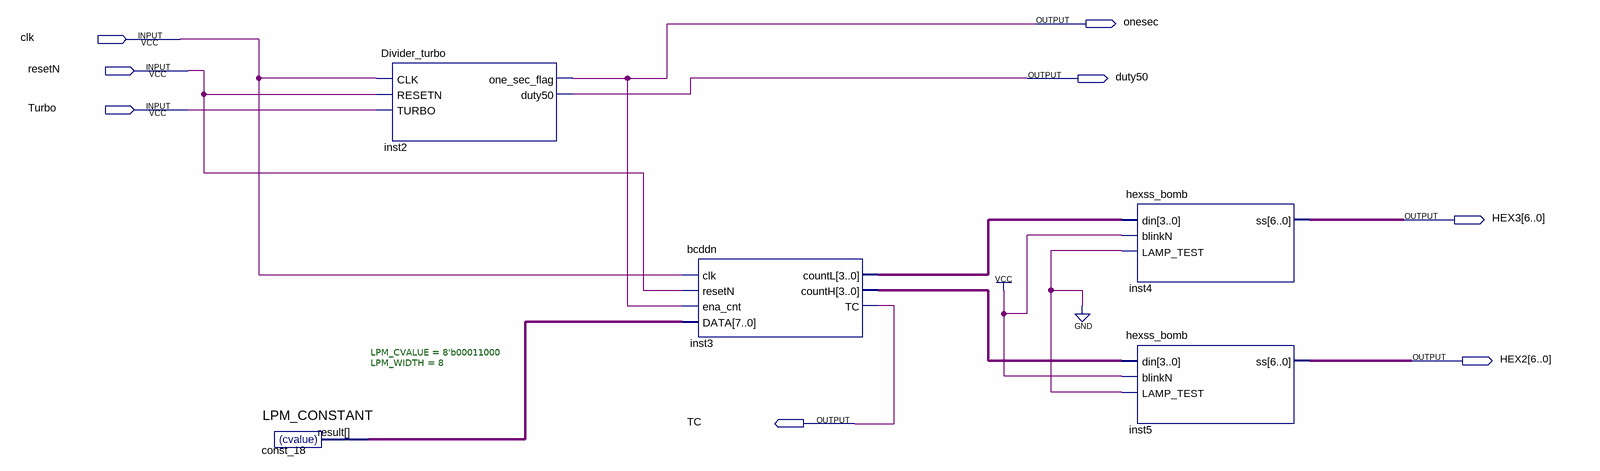
[diagram p0: schematic sheet]
// Quartus schematic BCDDN_FPGA.bdf as structural Verilog: 5 symbols, 8 pins
module BCDDN_FPGA (
  input  clk,
  input  resetN,
  input  Turbo,
  output onesec,
  output duty50,
  output [6:0] HEX3,
  output [6:0] HEX2,
  output TC
);

  wire [3:0] inst3_counth, inst3_countl;
  wire [7:0] const_18_result;

  LPM_CONSTANT #(.LPM_CVALUE(8'b00011000), .LPM_WIDTH(8)) const_18 (.result(const_18_result));
  Divider_turbo inst2 (.CLK(clk), .RESETN(resetN), .TURBO(Turbo), .one_sec_flag(onesec), .duty50(duty50));
  bcddn inst3 (
    .clk(clk), .resetN(resetN), .ena_cnt(onesec), .DATA(const_18_result), .countL(inst3_countl),
    .countH(inst3_counth), .TC(TC));
  hexss_bomb inst4 (.din(inst3_countl), .blinkN(1'b1), .LAMP_TEST(1'b0), .ss(HEX3));
  hexss_bomb inst5 (.din(inst3_counth), .blinkN(1'b1), .LAMP_TEST(1'b0), .ss(HEX2));
endmodule
